# Altium schematic sheet BlockDiagram.SchDoc: <title>
size A4; Organization: Institut d'Automatisation Industrielle; SheetNumber: 2; SheetTotal: 3; SVN: OUI; CurrentTime: 6; CurrentDate: 5; DocumentFullPathAndName: 8; DocumentName: 9; ModifiedDate: 13; ProjectName: <projet>
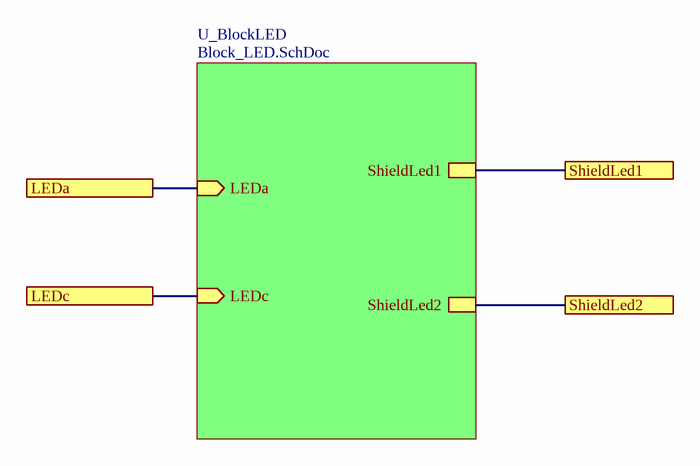
[diagram p0: BlockDiagram.SchDoc]

## Sub-sheets
U_BlockLED = Block_LED.SchDoc: ShieldLed1, ShieldLed2, LEDa (in), LEDc (in)

## Ports
LEDa, LEDc, ShieldLed1, ShieldLed2

## Nets
LEDa: port LEDa, sheet U_BlockLED/LEDa
LEDc: port LEDc, sheet U_BlockLED/LEDc
ShieldLed1: port ShieldLed1, sheet U_BlockLED/ShieldLed1
ShieldLed2: port ShieldLed2, sheet U_BlockLED/ShieldLed2

## Notes on the sheet
- Title
- Institut d'automatisation industrielle
  rte de Cheseaux 1
  CH-1401 Yverdon-les-Bains
  T +41(0)24 55 77 377    F +41(0)24 55 76 320
  http://iai.heig-vd.ch       iai@heig-vd.ch
- Date:
- Size:
- A4
- Project:
- Sheet
- of
- No.
- Author:
- SVN
- Version
- File: